# Altium project PADS_Project.PrjPcb
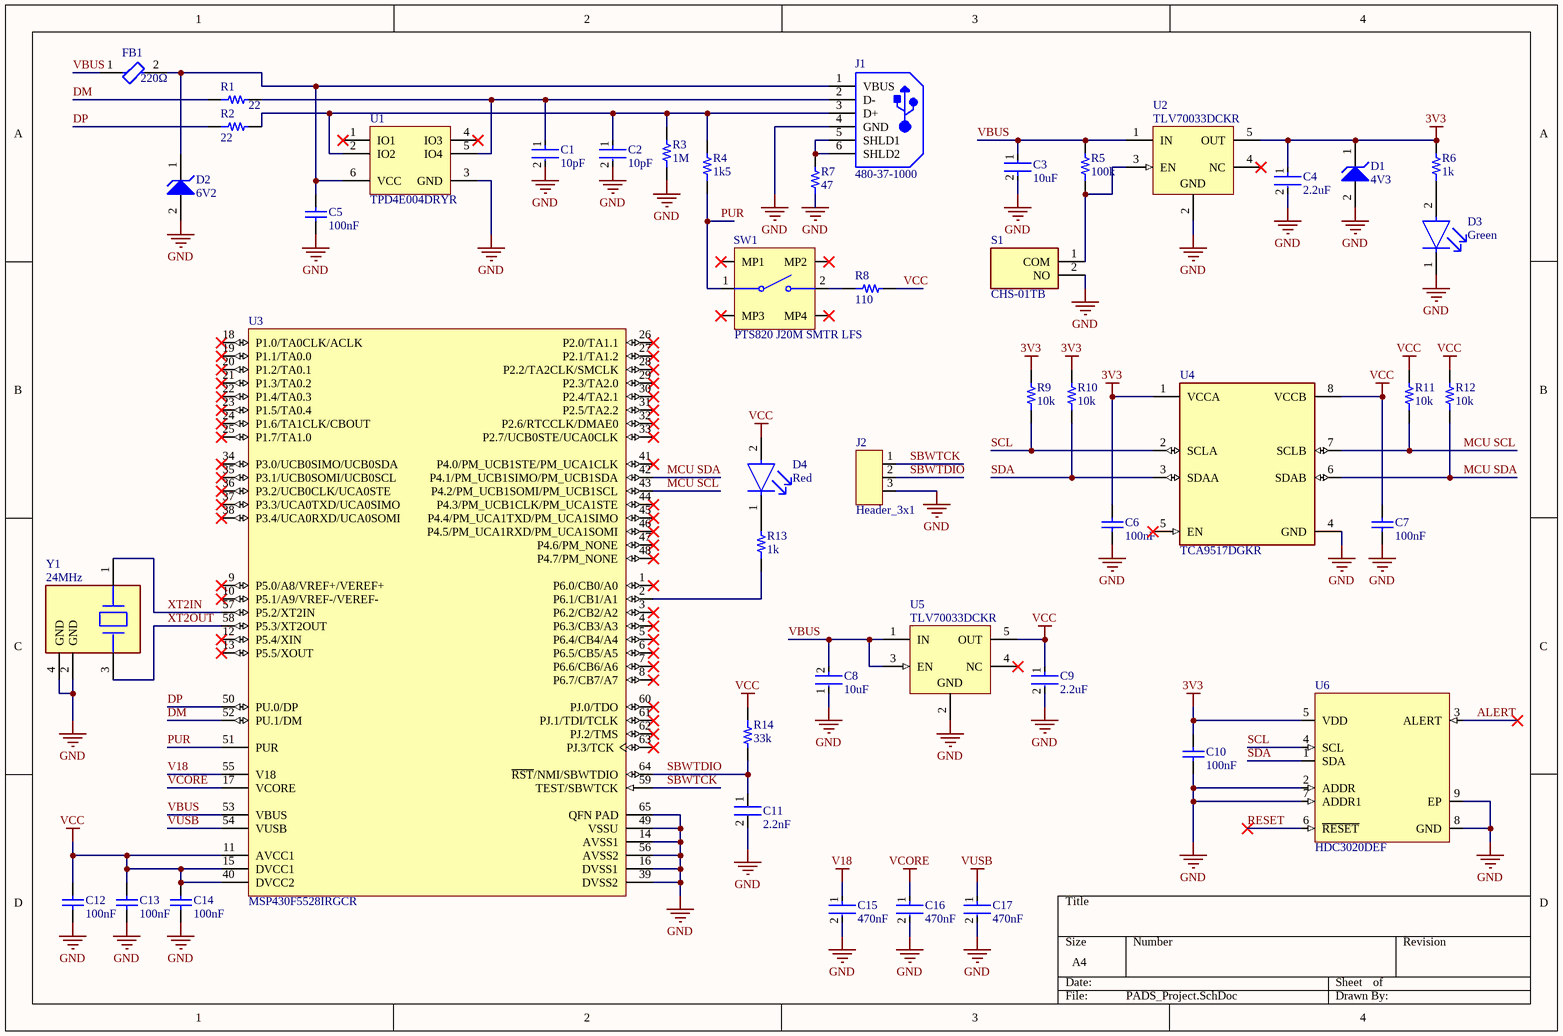
[diagram p0: PADS_Project.SchDoc]
1 sheet, 47 parts. Net scope: global (net labels, ports and power ports of the same name join across sheets).
Board file: PADS_PCB.PcbDoc

## Sheet PADS_Project.SchDoc
size A4; SheetNumber: 1; SheetTotal: 1

### Parts
C1  10pF  [FP-C0402-BB-IPC_A]
C2  10pF  [FP-C0402-BB-IPC_A]
C3  10uF  [FP-C1608-080-0_1-IPC_A]
C4  2.2uF  [FP-GRM155-0_2-IPC_A]
C5  100nF  [CAPC1005X55X25LL05T10]
C6  100nF  [CAPC1005X55X25ML05T10]
C7  100nF  [CAPC1005X55X25ML05T10]
C8  10uF  [FP-C1608-080-0_1-IPC_A]
C9  2.2uF  [FP-GRM155-0_2-IPC_A]
C10  100nF  [CAPC1005X55X25ML05T10]
C11  2.2nF  [RES]
C12  100nF  [CAPC1005X55X25ML05T10]
C13  100nF  [CAPC1005X55X25ML05T10]
C14  100nF  [CAPC1005X55X25ML05T10]
C15  470nF  [FP-0402-L_1_0_0_05-W_0_5-IPC_A]
C16  470nF  [FP-0402-L_1_0_0_05-W_0_5-IPC_A]
C17  470nF  [FP-0402-L_1_0_0_05-W_0_5-IPC_A]
D1  4V3  [ONSC-SOD-323-2-477-02_V]
D2  6V2  [ONSC-SOD-323-2-477-02_V]
D3  Green  [FP-APHCM2012CGCK-F01-MFG]
D4  Red  [FP-SML-LX0603SIW-TR-MFG]
FB1  220Ω  [FP-BLM15-0_05-IPC_A]
J1  480-37-1000  [MOLX-480-37-1000_V]
J2  Header_3x1  [Header_3x1]
R1  22  [RES]
R2  22  [RES]
R3  1M  [RES]
R4  1k5  [RES]
R5  100k  [RES]
R6  1k  [RES]
R7  47  [RES]
R8  110  [RES]
R9  10k  [RES]
R10  10k  [RES]
R11  10k  [RES]
R12  10k  [RES]
R13  1k  [RES]
R14  33k  [RES]
S1  CHS-01TB  [CHS01TB]
SW1  PTS820 J20M SMTR LFS  [PTS820J20MPSMTRLFS]
U1  TPD4E004DRYR  [DRY0006A]
U2  TLV70033DCKR  [DCK0005A_M]
U3  MSP430F5528IRGCR  [RGC0064B]
U4  TCA9517DGKR  [FP-DGK0008A-MFG]
U5  TLV70033DCKR  [DCK0005A_M]
U6  HDC3020DEF  [SON50P250X250X80-9N-D]
Y1  24MHz  [FP-ABM11W-MFG]

### Nets
3V3: C4.1 C6.2 C10.2 D1.1(K) R6.2 R9.2 R10.2 U2.5(OUT) U4.1(VCCA) U6.5(VDD)
GND: C1.2 C2.2 C3.2 C4.2 C5.1 C6.1 C7.1 C8.1 C9.2 C10.1 C11.2 C12.1 C13.1 C14.1 C15.2 C16.2 C17.2 D1.2(A) D2.2(A) D3.1(C) J1.4(GND) J2.3 R3.1 R7.1 S1.2(NO) U1.3(GND) U2.2(GND) U3.14(AVSS1) U3.16(DVSS1) U3.39(DVSS2) U3.49(VSSU) U3.56(AVSS2) U3.65(QFN_PAD) U4.4(GND) U5.2(GND) U6.2(ADDR) U6.7(ADDR1) U6.8(GND) U6.9(EP) Y1.2(GND) Y1.4(GND)
V18: C15.1 U3.55(V18)
VCC: C7.2 C9.1 C12.2 C13.2 C14.2 D4.2(A) R8.2 R11.2 R12.2 R14.1 U3.11(AVCC1) U3.15(DVCC1) U3.40(DVCC2) U4.8(VCCB) U5.5(OUT)
VCORE: C16.1 U3.17(VCORE)
VUSB: C17.1 U3.54(VUSB)
ALERT: U6.3(ALERT)
DM: R1.1 U3.52(PU.1/DM)
DP: R2.1 U3.50(PU.0/DP)
MCU SCL: R11.1 U3.43(P4.2/PM_UCB1SOMI/PM_UCB1SCL) U4.7(SCLB)
MCU SDA: R12.1 U3.42(P4.1/PM_UCB1SIMO/PM_UCB1SDA) U4.6(SDAB)
PUR: R4.1 SW1.1 U3.51(PUR)
RESET: U6.6(~{RESET})
SBWTCK: J2.1 U3.59(TEST/SBWTCK)
SBWTDIO: C11.1 J2.2 R14.2 U3.64(~{RST}/NMI/SBWTDIO)
SCL: R9.1 U4.2(SCLA) U6.4(SCL)
SDA: R10.1 U4.3(SDAA) U6.1(SDA)
VBUS: C3.1 C8.2 FB1.1 R5.2 U2.1(IN) U3.53(VBUS) U5.1(IN) U5.3(EN)
XT2IN: U3.57(P5.2/XT2IN) Y1.1
XT2OUT: U3.58(P5.3/XT2OUT) Y1.3
NetC1_1: C1.1 J1.2(D-) R1.2 U1.5(IO4)
NetC2_1: C2.1 J1.3(D+) R2.2 R3.2 R4.2 U1.2(IO2)
NetC5_2: C5.2 D2.1(K) FB1.2 J1.1(VBUS) U1.6(VCC)
NetD3_2: D3.2(A) R6.1
NetD4_1: D4.1(C) R13.2
NetJ1_5: J1.5(SHLD1) J1.6(SHLD2) R7.2
NetR5_1: R5.1 S1.1(COM) U2.3(EN)
NetR8_1: R8.1 SW1.2
NetR13_1: R13.1 U3.2(P6.1/CB1/A1)

Not connected (* = marked no-connect by the designer): SW1 ?1(MP3)* ?2(MP1)* ?3(MP2)* ?4(MP4)*; U1 1(IO1)* 4(IO3)*; U2 4(NC)*; U3 1(P6.0/CB0/A0)* 3(P6.2/CB2/A2)* 4(P6.3/CB3/A3)* 5(P6.4/CB4/A4)* 6(P6.5/CB5/A5)* 7(P6.6/CB6/A6)* 8(P6.7/CB7/A7)* 9(P5.0/A8/VREF+/VEREF+)* 10(P5.1/A9/VREF-/VEREF-)* 12(P5.4/XIN)* 13(P5.5/XOUT)* 18(P1.0/TA0CLK/ACLK)* 19(P1.1/TA0.0)* 20(P1.2/TA0.1)* 21(P1.3/TA0.2)* 22(P1.4/TA0.3)* 23(P1.5/TA0.4)* 24(P1.6/TA1CLK/CBOUT)* 25(P1.7/TA1.0)* 26(P2.0/TA1.1)* 27(P2.1/TA1.2)* 28(P2.2/TA2CLK/SMCLK)* 29(P2.3/TA2.0)* 30(P2.4/TA2.1)* 31(P2.5/TA2.2)* 32(P2.6/RTCCLK/DMAE0)* 33(P2.7/UCB0STE/UCA0CLK)* 34(P3.0/UCB0SIMO/UCB0SDA)* 35(P3.1/UCB0SOMI/UCB0SCL)* 36(P3.2/UCB0CLK/UCA0STE)* 37(P3.3/UCA0TXD/UCA0SIMO)* 38(P3.4/UCA0RXD/UCA0SOMI)* 41(P4.0/PM_UCB1STE/PM_UCA1CLK)* 44(P4.3/PM_UCB1CLK/PM_UCA1STE)* 45(P4.4/PM_UCA1TXD/PM_UCA1SIMO)* 46(P4.5/PM_UCA1RXD/PM_UCA1SOMI)* 47(P4.6/PM_NONE)* 48(P4.7/PM_NONE)* 60(PJ.0/TDO)* 61(PJ.1/TDI/TCLK)* 62(PJ.2/TMS)* 63(PJ.3/TCK)*; U4 5(EN)*; U5 4(NC)*

### Library data of the parts
C1 C2 = CMP-2008-03443-2: C0402C100K4GACTU / CAP CER 10PF 16V 10% NP0 0402; Manufacturer: Kemet; Material: Ceramic; Temperature Characteristic: C0G; Temperature Coefficient: 15%; Tolerance: 0.1; Device Class L2: Capacitors; Temperature Range High: +125°C; Device Class L3: Ceramic Capacitors; Height: 0.55mm; Mouser Description: Multilayer Ceramic Capacitors MLCC - SMD/SMT 16volts 10pF C0G 10%; Temperature Range Low: -55°C; Digikey Description: CAP CER 10PF 16V 10% NP0 0402; Device Class L1: Passive Components; ComponentLink2URL: https://content.kemet.com/datasheets/KEM_C1002_X7R_SMD.pdf; Package: C0402-BB; Automotive: No; Manufacturer Part Number: C0402C100K4GACTU; Ipc Land Pattern Name: CAPC10050X50; Voltage Rating: 16 V; Category: Cap; Lead Free: Yes; RoHS: TRUE; Temperature: -55°C to +125°C; Capacitance: 10 pF; Value: 10 pF; ComponentLink2Description: Datasheet; Octopart: https://octopart.com/c0402c100k4gactu-kemet-12569135
C3 C8 = CMP-2000-04980-2: C1608X5R1A106M080AC / Multilayer Ceramic Capacitors 10μF ±20% 10V X5R SMD 0603; Min Operating Temperature: -55°C; RoHS Compliant: Yes; Package Quantity: 1; Max Operating Temperature: 85°C; Radiation Hardening: No; Packaging: Tape and Reel; REACH SVHC: No SVHC; Length: 1.6mm; Case/Package: 0603; Series: C; Voltage Rating: 10V; Thickness: 0.035inch; Weight: 7.1E-05oz; Dielectric: X5R; Termination: SMD/SMT; Dielectric Material: Ceramic; Mount: Surface Mount; Construction: Flat; Resistor Type: Ceramic; Capacitance: 10uF; Tolerance: 20%; Case Code (Metric): 1608; Number of Pins: 2; Case Code (Imperial): 0603; Depth: 0.8mm; Lead Free: Lead Free; Width: 0.031inch; Height: 0.8mm; Voltage Rating (DC): 10V
C4 C9 = CMP-06035-001793-1: GRM155R61C225KE11D / Chip Multilayer Ceramic Capacitors for General Purpose, 0402, 2.2uF, X5R, 15%, 10%, 16V; Tolerance: 10%; Capacitance: 2.2uF; Packaging: Tape and Reel; Lead Free: Lead Free; Mount: Surface Mount; Width: 0.02inch; Case/Package: 0402; Case Code (Metric): 1005; Thickness: 0.022inch; Max Operating Temperature: 85°C; Min Operating Temperature: -55°C; Voltage Rating: 16V; Voltage Rating (DC): 16V; Material: Ceramic; Height: 0.3mm; Case Code (Imperial): 0402; Length: 0.039inch
C5-C7 C10 C12-C14 = CMP-2000-06554-2: LMK105BJ104KV-F / CAP, CERM, 0.1 uF, 10 / V,+/- 10%, X5R, 0402; Voltage Rating (DC): 10V; Contact Plating: Tin; Max Operating Temperature: 85°C; Depth: 0.5mm; Lead Free: Lead Free; Radiation Hardening: No; Length: 1mm; Width: 0.02inch; Capacitance: 100nF; Voltage Rating: 10V; Min Operating Temperature: -55°C; Termination: SMD/SMT; RoHS Compliant: Yes; Dielectric: X5R; Number of Pins: 2; Resistor Type: Ceramic; Mount: Surface Mount; Series: M; Case Code (Imperial): 0402; Halogen Free: Halogen Free; Height: 0.5mm; Tolerance: 10%; Case/Package: 0402; Thickness: 0.022inch; REACH SVHC: No SVHC; Package Quantity: 1; Case Code (Metric): 1005; Packaging: Tape and Reel; Construction: Flat
C11 = CAP: CL05B222JB5NNNC / CAP, CERM, 2200 pF, 50 / V, +/- 5%, X7R, 0402; Supplier: Arrow Electronics; Supplier Part Number: CL05B222JB5NNNC
C15-C17 = CMP-14477-000096-2: JMK105B7474KVHF / CAP, CERM, 0.47 uF, 6.3 / V, +/- 10%, X7R, 0402; Voltage Rating (DC): 6.3V; RoHS Compliant: Yes; Case Code (Metric): 1005; Length: 0.039inch; Package Quantity: 10000; Case/Package: 0402; Min Operating Temperature: -55°C; Thickness: 0.022inch; Tolerance: 10%; Mount: Surface Mount; Halogen Free: Halogen Free; Width: 0.5mm; Ratings: AEC-Q200; Dielectric: X7R; Capacitance: 470nF; Lead Free: Lead Free; Packaging: Tape and Reel; Max Operating Temperature: 125°C; Voltage Rating: 6.3V; Height: 0.5mm; Weight: 2.3E-05oz; Termination: SMD/SMT; Case Code (Imperial): 0402
D1 = CMP-1060-00656-1: SZMM3Z4V3T1G / Zener Voltage Regulator, 300 mW, 2-Pin SOD-323, Pb-Free, Tape and Reel; Manufacturer: On Semiconductor; P Max (W): 0.3; VZ Typ (V): 4.3; PackageVersion: Rev. H, 03/2007; ComponentLink1Description: Manufacturer URL; PackageReference: SOD-323-2-477-02; DatasheetVersion: Rev. 9; ComponentLink1URL: http://www.onsemi.com/; ComponentLink3URL: http://www.onsemi.com/pub_link/Collateral/477-02.PDF.1; Mounting Technology: Surface Mount; PartNumber: SZMM3Z4V3T1G; Packing: Tape and Reel; ComponentLink2Description: Datasheet; RoHS: Pb-Free; PackageDescription: 2-Pin SOD, Body 1.7 x 1.25 mm; ComponentLink2URL: http://www.onsemi.cn/pub_link/Collateral/MM3Z2V4T1-D.PDF; ComponentLink3Description: Package Specification
D2 = CMP-1060-00681-1: SZMM3Z6V2ST1G / Zener Voltage Regulator, 300 mW, Tight Tolerance Portfolio, 2-Pin SOD-323, Pb-Free, Tape and Reel; Manufacturer: On Semiconductor; P Max (W): 0.3; PartNumber: SZMM3Z6V2ST1G; PackageVersion: Rev. H, 03/2007; RoHS: Pb-Free; ComponentLink1URL: http://www.onsemi.com/; PackageReference: SOD-323-2-477-02; PackageDescription: 2-Pin SOD, Body 1.7 x 1.25 mm; ComponentLink1Description: Manufacturer URL; DatasheetVersion: Rev. 21; Mounting Technology: Surface Mount; ComponentLink2URL: http://www.onsemi.cn/pub_link/Collateral/MM3Z2V4ST1-D.PDF; ComponentLink2Description: Datasheet; ComponentLink3URL: http://www.onsemi.com/pub_link/Collateral/477-02.PDF.1; ComponentLink3Description: Package Specification; Packing: Tape and Reel
D3 = CMP-44529-000062-1: APHCM2012CGCK-F01 / LED GREEN CLEAR CHIP SMD; Dominant Wavelength: 570nm; Forward Current: 20mA; Number of LEDs: 1; Luminous Intensity: 40mcd; Forward Voltage: 2.1V; Viewing Angle: 110°; Illumination Color: Green; Lens Style: Clear; Mount: Surface Mount; Length: 2mm; Max Operating Temperature: 85°C; Series: APHCM; Width: 1.25mm; Lead Free: Lead Free; Wavelength: 570nm; Package Quantity: 1; Number of Pins: 2; Case Code (Metric): 2012; RoHS Compliant: Yes; Packaging: Tape and Reel; Lens Color: Clear; Case/Package: 0805; Case Code (Imperial): 0805; Test Current: 20mA; Color: Green; Min Operating Temperature: -40°C; Height: 0.4mm
D4 = CMP-57192-000009-1: SML-LX0603SIW-TR / LED RED DIFFUSED SMD; Test Current: 20mA; Forward Voltage: 2V; Approvals: UL; Dominant Wavelength: 636nm; Viewing Angle: 140°; Lens Color: White; Luminous Intensity: 60mcd; Power Rating: 50mW; Number of LEDs: 1; Color: Red; Forward Current: 20mA; Moisture Sensitivity Level: 2; Case Code (Imperial): 0603; Lead Free: Lead Free; Lens Transparency: Diffused; Case Code (Metric): 1608; Height: 0.6mm; Max Operating Temperature: 85°C; Width: 0.8mm; Lens Style: Diffused; Illumination Color: Red; Wavelength: 636nm; REACH SVHC: No SVHC; Package Quantity: 1; RoHS Compliant: Yes; Case/Package: 0603; Number of Pins: 2; Packaging: Tape and Reel; Length: 1.6mm; Mount: Surface Mount; Min Operating Temperature: -25°C
FB1 = CMP-0686-00173-4: Chip Ferrite Bead, 0402, 220Ω @ 100MHz, 0.29Ω, 25%, 450mA; Impedance: 220R; Shielding: Unshielded; Number of Lines: 1; DC Resistance (DCR): 290mR; DC Current: 300mA; Resistance: 350mR; Material: Steel; Radiation Hardening: No; Number of Pins: 2; REACH SVHC: No SVHC; Min Operating Temperature: -55°C; Width: 0.5mm; Lead Free: Lead Free; Case/Package: 0402; Case Code (Imperial): 0402; Max Current Rating: 450mA; Max Operating Temperature: 125°C; Length: 1mm; Tolerance: 25%; Current Rating: 450mA; Core Material: Ferrite; Depth: 0.55mm; Max DC Current: 300mA; Military Standard: Not; Termination: SMD/SMT; Height: 0.5mm; Packaging: Tape and Reel; Package Quantity: 1; Test Frequency: 100MHz; Number of Circuits: 1; RoHS Compliant: Yes; Case Code (Metric): 1005
J1 = CMP-1676-00005-2: Universal Serial Bus (USB) Shielded I/O Plug, Type A, Right Angle Connector, 1.5 A, -20 to 85 degC, 4-Pin SMD, RoHS, Tray; Voltage Rating (DC): 50 V; Tolerance: 1%; Resistance: 1 mohm; Power Rating: 100 mW; Case\Package: 0603; PackageDescription: 4-Pin Surface Mount Device, Body 12 x 18.8 mm; Max Operating Temperature: 155 degC; PackageReference: 480-37-1000; ComponentLink2Description: Datasheet; ComponentLink1Description: Manufacturer URL; Packaging: Tape and Reel; REACH SVHC: No SVHC; Width: 0.8 mm; Case Code (Imperial): 0603; Pins: 2; Length: 1.6 mm; DatasheetVersion: Rev. D, 06/2004; Voltage Rating: 50 V; ComponentLink1URL: http://www.molex.com/; Mount: Surface Mount; Case Code (Metric): 1608; ComponentLink2URL: http://www.molex.com/pdm_docs/sd/480371000_sd.pdf; RoHSCompliant: true; Min Operating Temperature: -55 degC; Package Quantity: 5000; Height: 0.45 mm
J2 = Header 3x1
R1-R14 = RES
S1 = CHS-01TB: DIP Switches / SIP Switches smd slide 1 pos., gull wing, washable with seal tape, 1/2 pitch; Manufacturer_Name: Nidec Copal; Geometry.Height: 2.5mm; Mouser Part Number: 229-CHS-01TB; Mouser Price/Stock: https://www.mouser.co.uk/ProductDetail/Nidec-Components/CHS-01TB?qs=XeJtXLiO41QqOM3HIs2O2A%3D%3D; Manufacturer_Part_Number: CHS-01TB; Datasheet Link: https://www.nidec-copal-electronics.com/e/catalog/switch/chs.pdf
U1 = CMP-0326-00024-3: ESD-Protection Array for High-Speed Data Interfaces, 4 Channels, -40 to +85 degC, 6-pin SON (DRY), Green (RoHS & no Sb/Br); Manufacturer: Texas Instruments; USB High Speed: TRUE; IO Capacitance(Typ)(pF): 1.6; IEC 61000-4-2 Air-Gap(+/- kV): 12; SubFamily: ESD Solution; IO Leakage Current(nA): 1; Breakdown Voltage(Min)(V): 6; IEC 61000-4-2 Contact(+/- kV): 8; ComponentLink3Description: URL Link1; ComponentLink3URL: SamplesURL:http://www.ti.com/product/tpd4e004#samples; PackageReference: DRY0006A; ComponentLink2URL: http://www.ti.com/general/docs/lit/getliterature.tsp?genericPartNumber=TPD4E004&fileType=pdf; ComponentLink2Description: Datasheet; DatasheetVersion: SLVS729A; ComponentLink1Description: Manufacturer URL; PackageDescription: 6-Pin Plastic Small Outline No-Lead, 1 x 1.45 x 0.6 mm Body, 0.5 mm Pitch; 1394 / Firewire: TRUE; Serial ATA / eSATA: TRUE; Eco-Plan: Green (RoHS & no Sb/Br); ComponentLink1URL: http://www.ti.com/; PackageVersion: revF, Dec-2011; Mounting Technology: Surface Mount; PartNumber: TPD4E004DRYR
U2 U5 = CMP-0394-00820-2: Single Output LDO, 200 mA, Fixed 3.3 V Output, 2 to 5.5 V Input, with Low IQ, 5-pin SC70 (DCK), -40 to 125 degC, Green (RoHS & no Sb/Br); Manufacturer: Texas Instruments; SubFamily: Single Channel LDO; Fixed Output Options(V): 3.3; Vin(Max)(V): 5.5; Vin(Min)(V): 2; Vdo(Typ)(mV): 175; Iq(Typ)(mA): 0.03; Iout(Max)(A): 0.2; Code_JEDEC: MO-203; ComponentLink2URL: http://www.ti.com/general/docs/lit/getliterature.tsp?genericPartNumber=TLV70033&fileType=pdf; PackageDescription: 5-Pin Plastic Small-Outline, Body 2 x 1.25 mm, Pitch 0.65 mm; ComponentLink1Description: Manufacturer URL; PartNumber: TLV70033DCKR; Vout Adj(Max)(V): 3.3; ComponentLink1URL: http://www.ti.com/; ComponentLink2Description: Datasheet; Vout Adj(Min)(V): 3.3; Mounting Technology: Surface Mount; Eco-Plan: Green (RoHS & no Sb/Br); Accuracy(%): 2; DatasheetVersion: SLVSA00D; ComponentLink3URL: http://www.ti.com/litv/pdf/mpds025f; PackageReference: DCK0005A; PackageVersion: 4093553-3/G; ComponentLink3Description: Package Specification
U3 = CMP-0365-00971-2: 25 MHz Mixed Signal Microcontroller with 128 KB Flash, 8192 B SRAM and 47 GPIOs, -40 to 85 degC, 64-pin QFN (RGC), Green (RoHS & no Sb/Br); Manufacturer: Texas Instruments; Watchdog: Yes; USB: 1; DMA: 3; ADC: 12-bit SAR; Flash(KB): 128; USCI_B (I2C & SPI): 2; ADC Channels: 16; Timers - 16-bit: 4; SRAM(B): 8192; SubFamily: 5 Series; GPIO: 47; Multiplier: 32x32; Frequency(MHz): 25; Comparators: Yes; Temp Sensor: Yes; PackageReference: RGC0064B; ComponentLink2Description: Datasheet; DatasheetVersion: SLAS590I; PartNumber: MSP430F5528IRGCR; PackageVersion: 4204106/F; Eco-Plan: Green (RoHS & no Sb/Br); Brown Out Reset: Yes; SVS: Yes; PackageDescription: 64-Pin Plastic Flat Pack, Body 9 x 9 mm, Pitch 0.5 mm; Mounting Technology: Surface Mount; ComponentLink1Description: Manufacturer URL; USCI_A (UART/LIN/IrDA/SPI): 2; Real-Time Clock: Yes; ComponentLink2URL: http://www.ti.com/general/docs/lit/getliterature.tsp?genericPartNumber=MSP430F5528&fileType=pdf; ComponentLink3URL: http://www.ti.com/lit/ds/symlink/ucd3138.pdf; ComponentLink1URL: http://www.ti.com/; ComponentLink3Description: Package Specification
U4 = CMP-04881-000001-1: IC TRNSLTR BIDIRECTIONAL 8VSSOP; Manufacturer: Texas Instruments; Sigbufrep Type: Buffer; Interface: I2C,SMBus; Min Supply Voltage: 0.9V; Max Supply Voltage: 5.5V; Standoff Height: 0.05mm; Nominal Supply Current: 1.5-3mA; Input Capacitance: 6-8pF; Mouser Description: Interface - Signal Buffers, Repeaters Level-Translating I2C Bus Repeater; Manufacturer Part Number: TCA9517DGKR; Ambient Temperature Range Low: -40°C; ComponentLink2URL: http://www.ti.com/lit/ds/symlink/tca9517.pdf; Lead Free: Yes; Temperature: -40°C to +85°C; Device Class L1: Integrated Circuits (ICs); Temperature Range High: +85°C; Octopart: https://octopart.com/tca9517dgkr-texas+instruments-25896020; Ambient Temperature Range High: +85°C; Temperature Range Low: -40°C; Device Class L3: Repeaters; Device Class L2: Interface ICs; Category: IC; Height: 1.1mm; RoHS: TRUE; Automotive: No; ComponentLink2Description: Datasheet; Digikey Description: IC TRNSLTR BIDIRECTIONAL 8VSSOP; Package: DGK0008A; Ipc Land Pattern Name: SOP65P300X110-8
Y1 = CMP-27762-009177-1: ABM11W-24.0000MHZ-8-K1Z-T3 / Crystal 24MHz ±10ppm 8pF SMD-4 2mm x 1.6mm; RoHS Compliant: Yes